# EAGLE design dasblinkenhat-controller-mk-4.2 (EAGLE 7.5.0)
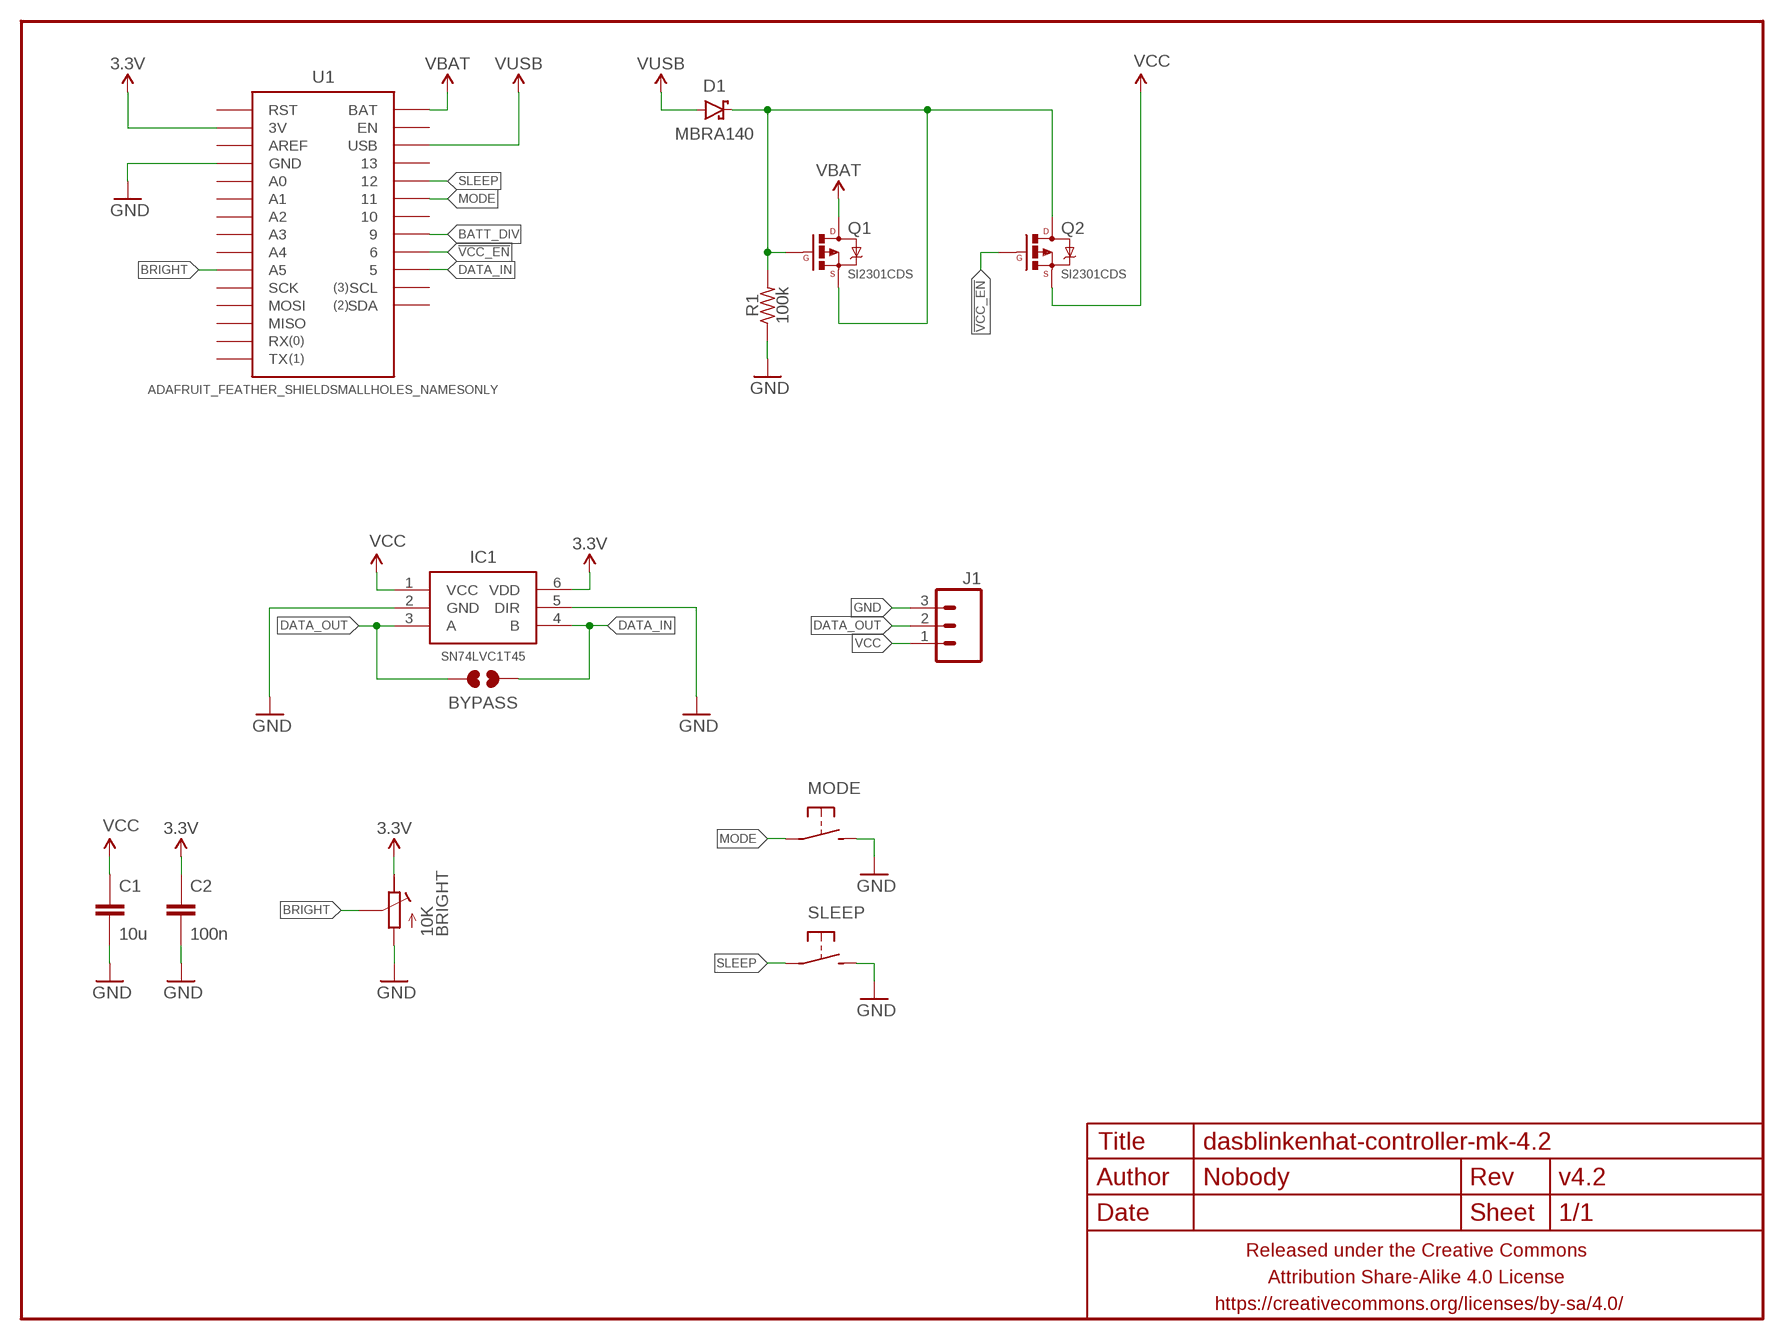
[diagram p0: schematic, sheet 1]

## Parts
BRIGHT  10K  POTENTIOMETEREVM3Y  [EVM3Y]
BYPASS  JUMPER-PAD-2-NOYES_SILK  [PAD-JUMPER-2-NO_YES_SILK]
C1  10u  CAPACITOR-CERAMICC0805  [C0805]
C2  100n  CAPACITOR-CERAMICC0603  [C0603]
D1  MBRA140  DIODE-SCHOTTKYMBRA140  [SMA-DIODE]
FRAME1  FRAME-LETTERNO_PACKAGE  [DUMMY]
IC1  SN74LVC1T45  SN74LVC1T45SOT23-6  [SOT23-6]
J1  M03JST-XH-RA-PTH  [JST-3-XH-RA-PTH]
MODE  DTS-6MM  SPST-NO-TACT12MM-PTH  [TACTILE-PTH-12MM]
Q1  SI2301CDS  MOSFET-PCHANNELSOT-23  [SOT23]
Q2  SI2301CDS  MOSFET-PCHANNELSOT-23  [SOT23]
R1  100k  RESISTORR0603  [R0603]
SLEEP  DTS-6MM  SPST-NO-TACT12MM-PTH  [TACTILE-PTH-12MM]
U1  ADAFRUIT_FEATHER_SHIELDSMALLHOLES_NAMESONLY  [ADAFRUIT_FEATHER_SMALLHOLES_NAMESONLY]

## Nets
3.3V: BRIGHT.E C2.1 IC1.6(VDD) U1.3V
!VCC_EN: Q2.1(G) U1.6
BATT_DIV: U1.9
BRIGHT: BRIGHT.S U1.A5
DATA_IN: BYPASS.1 IC1.4(B) U1.5
DATA_OUT: BYPASS.2 IC1.3(A) J1.2
GND: BRIGHT.A C1.2 C2.2 IC1.2(GND) IC1.5(DIR) J1.3 MODE.3 MODE.4 R1.1 SLEEP.3 SLEEP.4 U1.GND@0(GND) U1.GND@1(GND)
MODE: MODE.1 MODE.2 U1.11
N$1: D1.C Q1.1(G) Q1.2(S) Q2.3(D) R1.2
SLEEP: SLEEP.1 SLEEP.2 U1.12
VBAT: Q1.3(D) U1.BAT
VCC: C1.1 IC1.1(VCC) J1.1 Q2.2(S)
VUSB: D1.A U1.USB
Unconnected: U1.10 U1.13 U1.A0 U1.A1 U1.A2 U1.A3 U1.A4 U1.AREF U1.EN U1.MISO U1.MOSI U1.RST U1.RX U1.SCK U1.SCL U1.SDA U1.TX

## Library data of the parts
BRIGHT = a_parts:POTENTIOMETER: Trimm resistor
BYPASS = a_parts:JUMPER-PAD-2-NO
C1 C2 = a_parts:CAPACITOR-CERAMIC: CAPACITOR, European symbol
D1 = a_parts:DIODE-SCHOTTKY: Schottky diodes in SFE's production catalog BAT20J 1A 23V 0.62Vf RB751 120mA 40V 0.37Vf PMEG4005EJ 0.5A 40V 0.42Vf MBRA140 1A 40V 0.5Vf B340A 3A 40V SMA; PROD_ID: DIO-08053
FRAME1 = a_parts:FRAME-LETTER: Schematic Frame Standard 8.5x11 US Letter frame; DESIGNER: Nobody; VERSION: v4.2
IC1 = a_parts:SN74LVC1T45
J1 = a_parts:M03: Header 3 Standard 3-pin 0.1" header. Use with straight break away headers (SKU : PRT-00116), right angle break away headers (PRT-00553), swiss pins (PRT-00743), machine pins (PRT-00117), and female headers (PRT-00115). Molex polarized connector foot print use with SKU : PRT-08232 with associated crimp pins and housings.
MODE SLEEP = A_butts:SPST-NO-TACT
Q1 Q2 = a_parts:MOSFET-PCHANNEL: Generic PMOSFET IRLML2244 - TRANS-11153 (SOT-23 -20V -4.3A) (1.Gate 2.Source 3.Drain) FQP27P06 - COM-10349 <http://www.sparkfun.com/products/10349> (TO-220 -60V -27A) (1.Gate 2.Source 3.Drain)
R1 = a_parts:RESISTOR: RESISTOR, American symbol
U1 = a_parts:ADAFRUIT_FEATHER_SHIELD

## Board
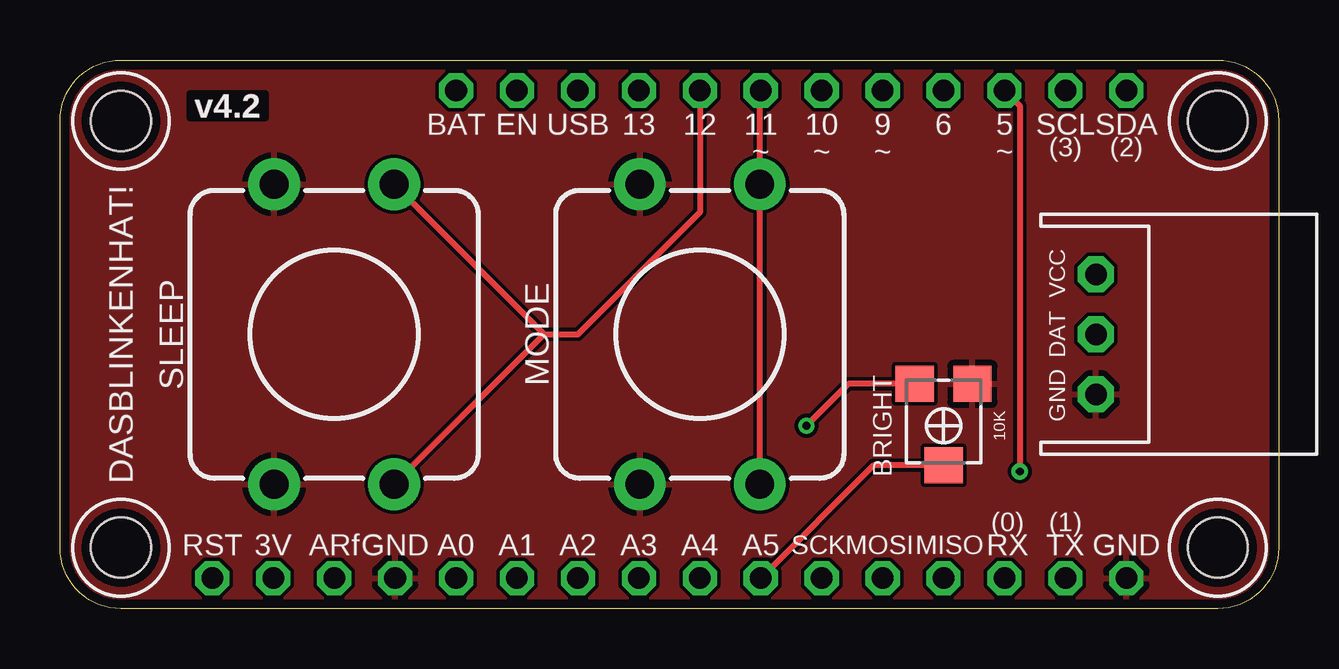
[diagram p1: board, top side]
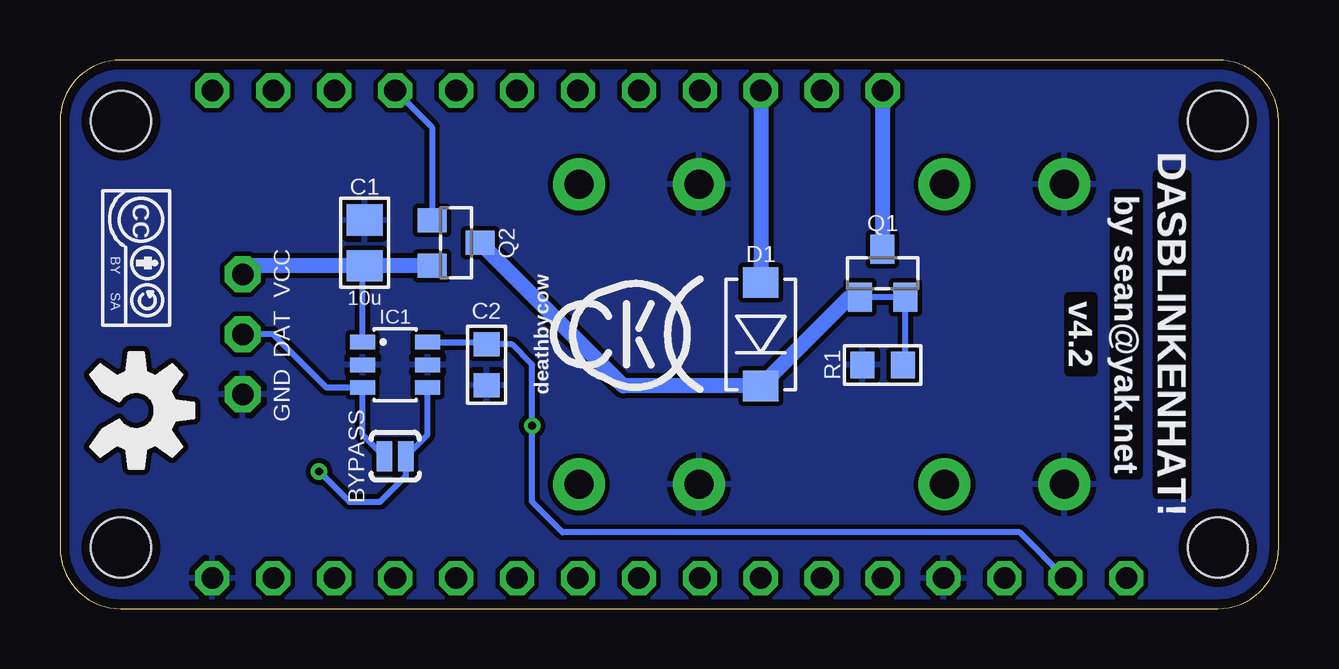
[diagram p2: board, bottom side, seen from below]

Size 50.8 x 22.86 mm. Coordinates in mm from the lower left corner, seen from the top.
Outline: 48.26,0 2.54,0 arc-90 0,2.54 0,20.32 arc-90 2.54,22.86 48.26,22.86 arc-90 50.8,20.32 50.8,2.54 arc-90 48.26,0
Copper layers (1*16): Top 0.0356mm / dielectric 1.5011mm / Bottom 0.0356mm
Design rules "LaenPCBOrder2": minimum track width 6mil, minimum drill 13mil, track to track 6mil, track to pad 6mil, pad to pad 6mil, via to via 6mil, smd to smd 6mil, copper to edge 15mil, drill to drill 6mil, minimum pad ring 7mil, minimum via ring 7mil, stop-mask expansion 3mil, vias tented up to drill 20mil, thermal gap 10mil
Holes 2.5 mm at 2.54,20.32 2.54,2.54 48.26,2.54 48.26,20.32

### Footprints (pad centres in the part's own frame; a part is rotated, then mirrored left to right if it is on the bottom)
EVM3Y = smd 1.6 x 1.5: A -1.2,-1.75; E 1.2,-1.75; S 0,1.65
PAD-JUMPER-2-NO_YES_SILK = smd 0.635 x 1.27: 1 -0.45,0; 2 0.45,0
C0805 = smd 1.3 x 1.5: 1 -0.95,0; 2 0.95,0
C0603 = smd 1 x 1.1: 1 -0.85,0; 2 0.85,0
SMA-DIODE = smd 1.27 x 1.47: A -2.15,0; C 2.15,0
SOT23-6 = smd 0.6 x 1.05: 1 -0.95,-1.35; 2 0,-1.35; 3 0.95,-1.35; 4 0.95,1.35; 5 0,1.35; 6 -0.95,1.35
JST-3-XH-RA-PTH = drill 0.9 pad 1.5 octagon: 1 -2.5,0; 2 0,0; 3 2.5,0
TACTILE-PTH-12MM = drill 1.2 pad 2.159: 1 6.25,-2.5; 2 -6.25,-2.5; 3 6.25,2.5; 4 -6.25,2.5
SOT23 = smd 1 x 1.2: 1 -0.95,-1; 2 0.95,-1; 3 0,1
R0603 = smd 1 x 1.1: 1 -0.85,0; 2 0.85,0
ADAFRUIT_FEATHER_SMALLHOLES_NAMESONLY = drill 0.9 pad 1.422 octagon: 3V -16.51,-10.16; 5 13.97,10.16; 6 11.43,10.16; 9 8.89,10.16; 10 6.35,10.16; 11 3.81,10.16; 12 1.27,10.16; 13 -1.27,10.16; A0 -8.89,-10.16; A1 -6.35,-10.16; A2 -3.81,-10.16; A3 -1.27,-10.16; A4 1.27,-10.16; A5 3.81,-10.16; AREF -13.97,-10.16; BAT -8.89,10.16; EN -6.35,10.16; GND@0 -11.43,-10.16; GND@1 19.05,-10.16; MISO 11.43,-10.16; MOSI 8.89,-10.16; RST -19.05,-10.16; RX 13.97,-10.16; SCK 6.35,-10.16; SCL 16.51,10.16; SDA 19.05,10.16; TX 16.51,-10.16; USB -3.81,10.16

### Placement (x,y rotation side)
BRIGHT  36.83,7.62 180 top
BYPASS  36.83,6.35 180 bottom
C1  38.1,15.24 90 bottom
C2  33.02,10.16 270 bottom
D1  21.59,11.43 270 bottom
FRAME1  0,0 0 top
IC1  36.83,10.16 270 bottom
J1  43.18,11.43 270 top
MODE  26.67,11.43 90 top
Q1  16.51,13.97 0 bottom
Q2  34.29,15.24 270 bottom
R1  16.51,10.16 0 bottom
SLEEP  11.43,11.43 90 top
U1  25.4,11.43 0 top
U$1  [CC-BY-SA-4.0-NO-URL]  47.62,14.61 270 bottom
U$3  [OSHWLOGO_5MM_METAL]  47.62,8.26 270 bottom
U$4  [COW_SMALL]  26.67,11.43 270 bottom

### Tracks (layer width: path | path; a pad name or v marks a point on that pad's centre or on a via)
3.3V  (via drill 0.33)
  Top 0.254: BRIGHT.E 32.87,9.37 v31.11,7.62
  Bottom 0.254: U1.3V 10.79,3.17 29.84,3.17 31.11,4.45 v31.11,7.62 31.11,10.16 31.96,11.01 C2.1 33.12,11.11 IC1.6
!VCC_EN
  Bottom 0.254: U1.6 35.29,20.05 Q2.1
BRIGHT
  Top 0.254: BRIGHT.S 33.91,5.97 U1.A5
DATA_IN  (via drill 0.33)
  Top 0.254: U1.5 40.01,20.95 v40.01,5.71
  Bottom 0.254: IC1.4 35.48,7.25 BYPASS.1 36.38,5.53 37.47,4.45 38.73,4.45 v40.01,5.71
DATA_OUT
  Bottom 0.254: J1.2 41.91,11.43 39.69,9.21 IC1.3 38.18,7.25 BYPASS.2
GND
  pour Top: 48.26,0 2.54,0 arc-90 0,2.54 0,20.32 arc-90 2.54,22.86 48.26,22.86 arc-90 50.8,20.32 50.8,2.54 arc-90
  pour Bottom (isolate 0.2): 48.26,0 2.54,0 arc-90 0,2.54 0,20.32 arc-90 2.54,22.86 48.26,22.86 arc-90 50.8,20.32 50.8,2.54 arc-90
MODE
  Top 0.254: MODE.2 MODE.1 29.17,21.55 U1.11
N$1
  Bottom 0.254: Q1.1 Q1.2 15.56,10.26 R1.2
  Bottom 0.635: Q1.1 17.9,12.97 D1.C 27.33,9.28 Q2.3
SLEEP
  Top 0.254: U1.12 26.67,16.51 21.59,11.43 20.32,11.43 20.18,11.43 | SLEEP.1 20.18,11.43 | SLEEP.2 20.18,11.43
VBAT
  Bottom 0.635: U1.BAT Q1.3
VCC
  Bottom 0.254: IC1.1 38.18,14.21 C1.1
  Bottom 0.635: J1.1 42.82,14.29 C1.1 Q2.2
VUSB
  Bottom 0.635: U1.USB D1.A

### Text on the board
tPlace: VCC | DAT | GND
bPlace: VCC | DAT | GND